# EAGLE schematic ECL2VGA_RevF.1 (EAGLE 6.4)
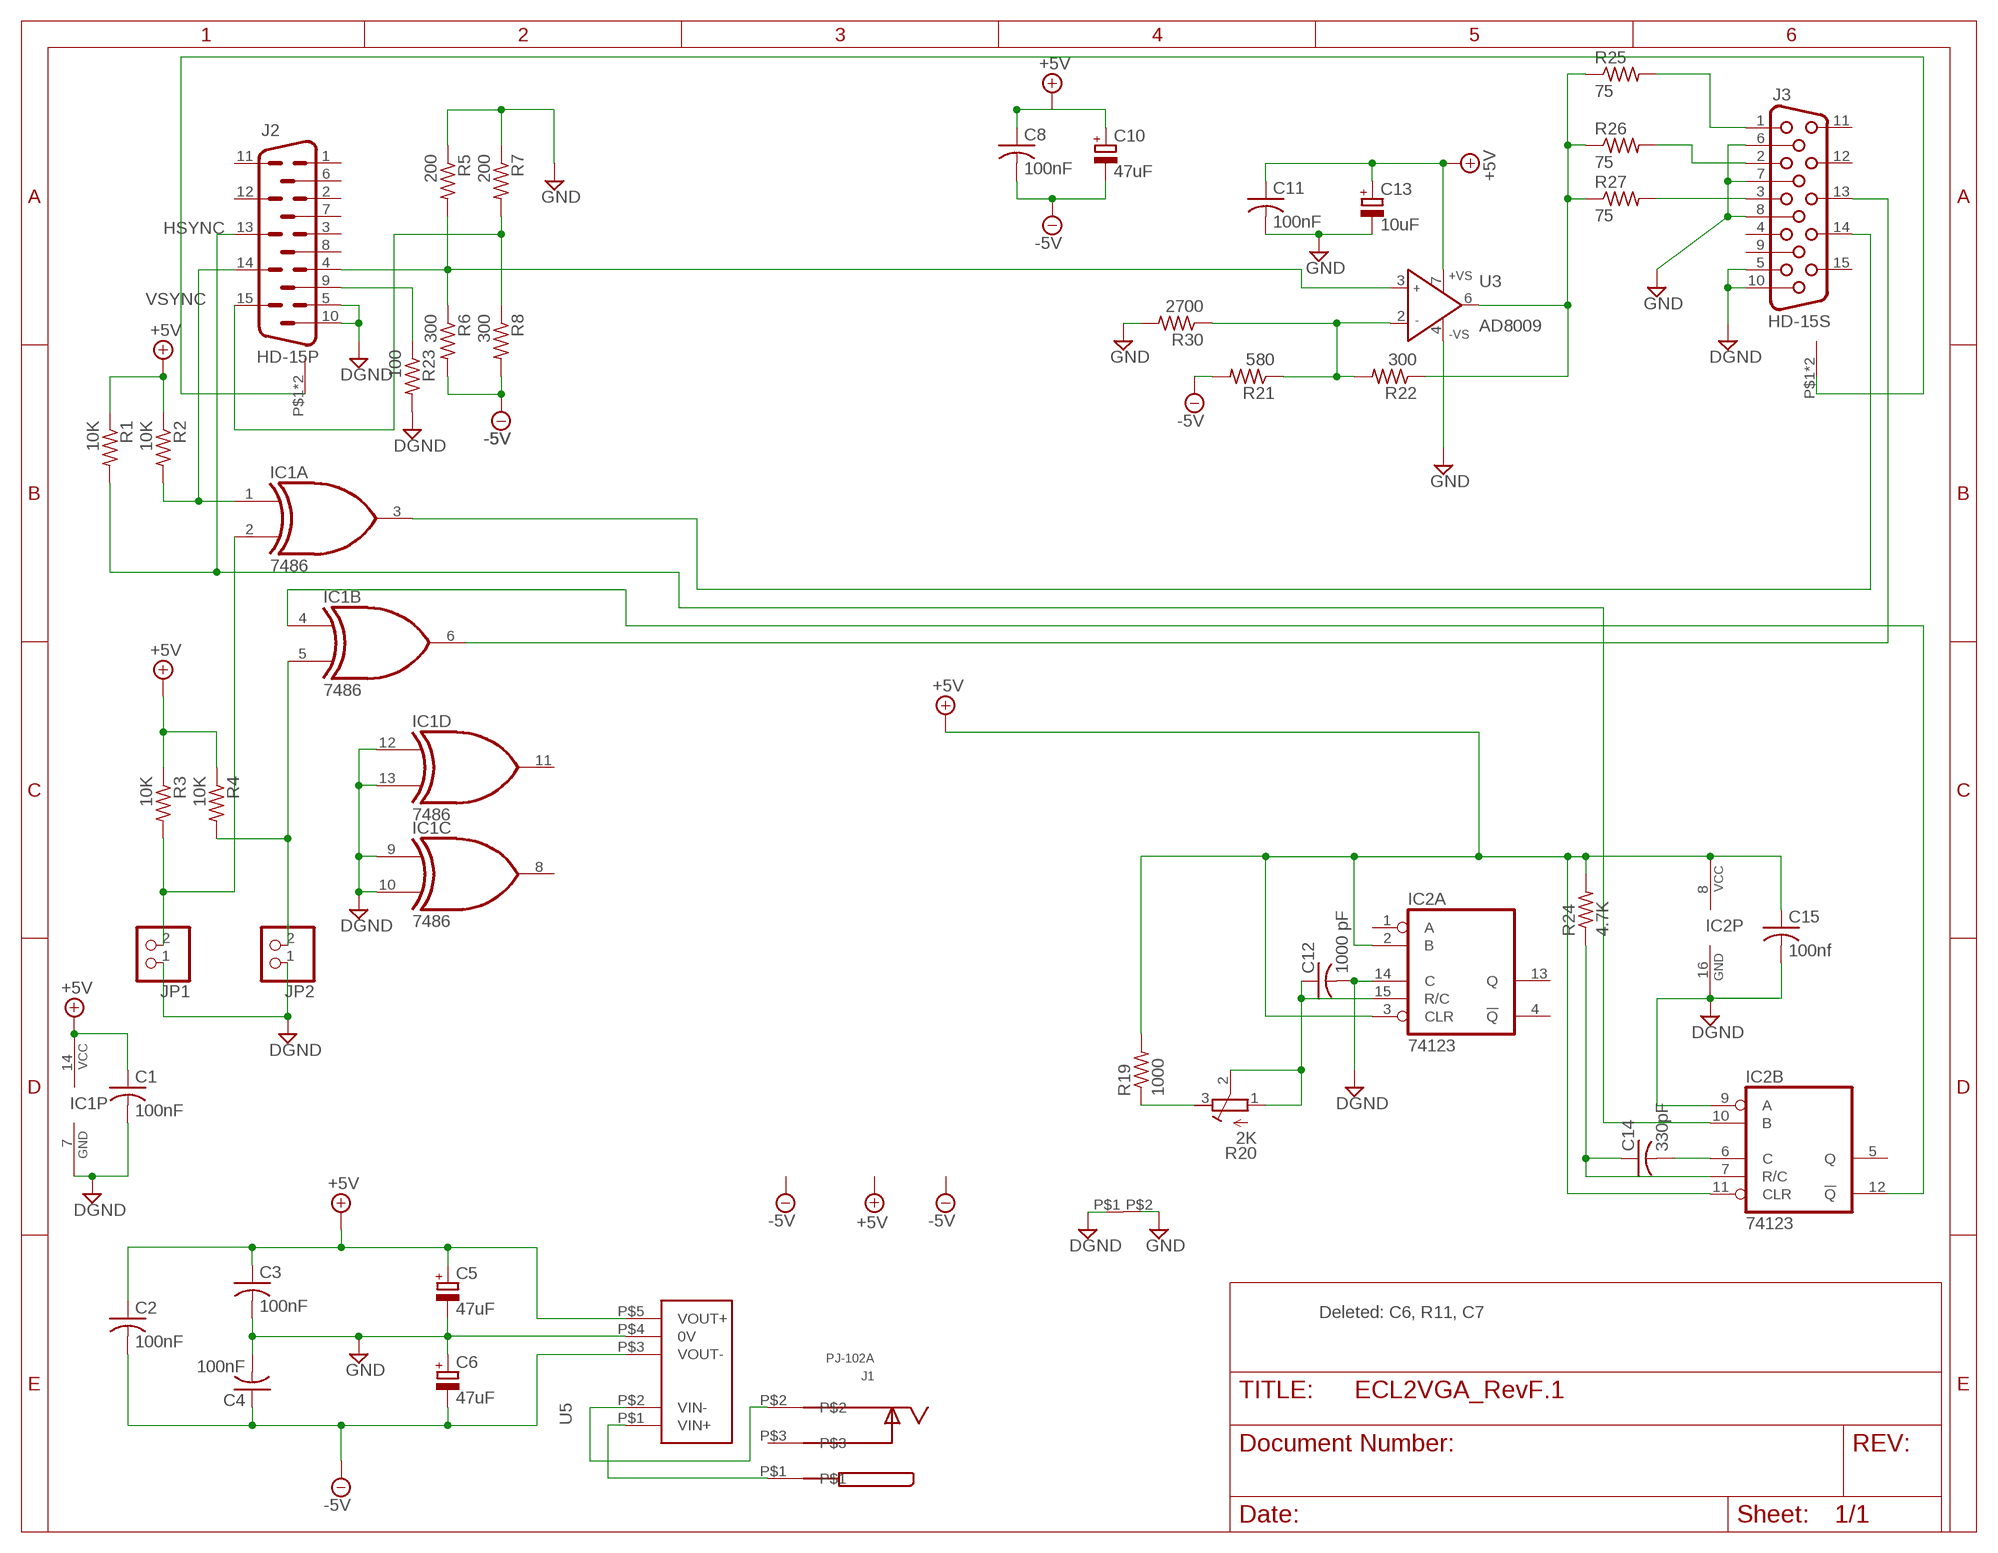
[diagram p0: schematic, sheet 1]

## Parts
C1  100nF  C-USC0805  [C0805]
C2  100nF  C-USC0805  [C0805]
C3  100nF  C-USC0805  [C0805]
C4  100nF  C-USC0805  [C0805]
C5  47uF  CPOL-EUCT6032  [CT6032]
C6  47uF  CPOL-EUCT6032  [CT6032]
C8  100nF  C-USC0805  [C0805]
C10  47uF  CPOL-EUCT6032  [CT6032]
C11  100nF  C-USC0805  [C0805]
C12  1000 pF  C-USC0805  [C0805]
C13  10uF  CPOL-EUCT6032  [CT6032]
C14  330pF  C-USC0805  [C0805]
C15  100nf  C-USC0805  [C0805]
IC1  7486  [TSSOP14]
IC2  74123  [TSSOP16]
J1  PJ-102A  [PJ-102A]
J2  HD-15P  HM15H  [HDM15H]
J3  HD-15S  HF15H  [HDF15H]
JP1  PINHD-1X2  [1X02]
JP2  PINHD-1X2  [1X02]
R1  10K  R-US_R0805  [R0805]
R2  10K  R-US_R0805  [R0805]
R3  10K  R-US_R0805  [R0805]
R4  10K  R-US_R0805  [R0805]
R5  200  R-US_R0805  [R0805]
R6  300  R-US_R0805  [R0805]
R7  200  R-US_R0805  [R0805]
R8  300  R-US_R0805  [R0805]
R19  1000  R-US_R0805  [R0805]
R20  2K  R-TRIMM64W  [RTRIM64W]
R21  580  R-US_R0805  [R0805]
R22  300  R-US_R0805  [R0805]
R23  100  R-US_R0805  [R0805]
R24  4.7K  R-US_R0805  [R0805]
R25  75  R-US_R0805  [R0805]
R26  75  R-US_R0805  [R0805]
R27  75  R-US_R0805  [R0805]
R30  2700  R-US_R0805  [R0805]
U3  AD8009  [SOIC8]
U5  MEJ2-5_0_+5  [MEJ2]
U$1  TRACE  [TRACE]

## Nets
0V: C2.2 C4.1 C6.- C8.2 C10.- R6.2 R8.2 U5.P$3(VOUT-) ; supply symbol labelled -5V
+5V: C1.1 C2.1 C3.1 C5.+ C8.1 C10.+ C11.1 C13.+ C15.1 IC1.14(P:VCC) IC2.2(A:B) IC2.3(A:CLR) IC2.8(P:VCC) IC2.11(B:CLR) R1.1 R2.1 R3.1 R4.1 R19.2 R24.2 U3.7(+VS) U5.P$5(VOUT+)
-5V: R21.2
DGND: C1.2 C12.2 C15.2 IC1.7(P:GND) IC1.9(C:I0) IC1.10(C:I1) IC1.12(D:I0) IC1.13(D:I1) IC2.9(B:A) IC2.14(A:C) IC2.16(P:GND) J2.5 J2.10 J3.5 J3.10 JP1.1 JP2.1 R23.2 U$1.P$1
ECL_H: J2.4 R5.2 R6.1 U3.3(IN+)
ECL_L: J2.15 R7.2 R8.1
GND: C3.2 C4.2 C5.- C6.+ C11.2 C13.- J3.6 J3.7 J3.8 R5.1 R7.1 R30.2 U3.4(-VS) U5.P$4(0V) U$1.P$2
N$1: J3.1 R25.2
N$2: J3.2 R26.2
N$3: J3.3 R27.2
N$4: IC2.10(B:B)
N$5: IC1.3(A:O) J3.14
N$6: IC1.6(B:O) J3.13
N$8: R21.1 R22.2 R30.1 U3.2(IN-)
N$9: R22.1 R25.1 R26.1 R27.1 U3.6(OUT)
N$10: IC1.5(B:I1) JP2.2 R4.2
N$15: J2.13 R1.2
N$16: IC1.1(A:I0) J2.14 R2.2
N$21: IC1.4(B:I0) IC2.12(B:!Q)
N$23: IC1.2(A:I1) JP1.2 R3.2
N$24: C14.1 IC2.7(B:R/C) R24.1
N$27: C14.2 IC2.6(B:C)
N$32: J2.9 R23.1
N$33: C12.1 IC2.15(A:R/C) R20.1(E) R20.2(S)
N$35: R19.1 R20.3(A)
N$36: J1.P$1 U5.P$1(VIN+)
N$37: J1.P$2 U5.P$2(VIN-)
SHEILD: J2.P$1 J2.P$2 J3.P$1 J3.P$2
Unconnected: IC1.8(C:O) IC1.11(D:O) IC2.1(A:A) IC2.4(A:!Q) IC2.5(B:Q) IC2.13(A:Q) J1.P$3 J2.1 J2.2 J2.3 J2.6 J2.7 J2.8 J2.11 J2.12 J3.4 J3.9 J3.11 J3.12 J3.15

## Notes on the sheet
- HSYNC
- VSYNC
- Deleted: C6, R11, C7

## Library data of the parts
C1-C4 C8 C11 C12 C14 C15 = resistor:C-US: CAPACITOR, American symbol
C5 C6 C10 C13 = resistor:CPOL-EU: POLARIZED CAPACITOR, European symbol
IC1 = 74xx-us:74*86: Quad 2-input EXCLUSIV-OR (XOR) gate
IC2 = 74xx-us:74*123: Retriggerable monostable MULTIVIBRATOR
J1 = MSD:PJ-102A
J2 = con-subd:HM15: SUB-D; OC_FARNELL: unknown; OC_NEWARK: unknown
J3 = con-subd:HF15: SUB-D; OC_FARNELL: unknown; OC_NEWARK: unknown
JP1 JP2 = pinhead:PINHD-1X2: PIN HEADER
R1-R8 R19 R21-R27 R30 = resistor:R-US_: RESISTOR, American symbol
R20 = resistor:R-TRIMM: Trimm resistor
U3 = analog-devices:AD8009
U5 = MSD:MEJ2-5_0_+5
U$1 = MSD:TRACE